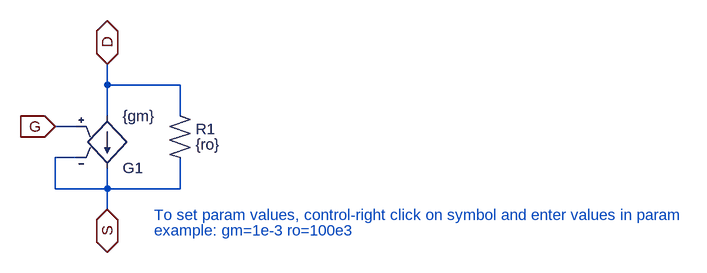
[diagram p0: schematic svg_ss_nmos.asc]
svg_ss_nmos.asc, the LTspice schematic file:
Version 4
SHEET 1 1096 680
WIRE 144 48 144 16
WIRE 256 48 144 48
WIRE 144 96 144 48
WIRE 256 96 256 48
WIRE 96 112 64 112
WIRE 96 160 64 160
WIRE 64 208 64 160
WIRE 144 208 144 176
WIRE 144 208 64 208
WIRE 256 208 256 160
WIRE 256 208 144 208
WIRE 144 240 144 208
FLAG 64 112 G
IOPIN 64 112 In
FLAG 144 240 S
IOPIN 144 240 BiDir
FLAG 144 16 D
IOPIN 144 16 BiDir
SYMBOL g2 144 192 M180
SYMATTR InstName G1
SYMATTR Value {gm}
SYMBOL svg\\svg_res 240 96 R0
SYMATTR InstName R1
SYMATTR Value {ro}
TEXT 216 272 Left 2 ;example: gm=1e-3 ro=100e3
TEXT 216 248 Left 2 ;To set param values, control-right click on symbol and enter values in param

The netlist it stands for:
* svg_ss_nmos.asc
G1 D S G S {gm}
R1 D S {ro}
* example: gm=1e-3 ro=100e3
* To set param values, control-right click on symbol and enter values in param
.backanno
.end